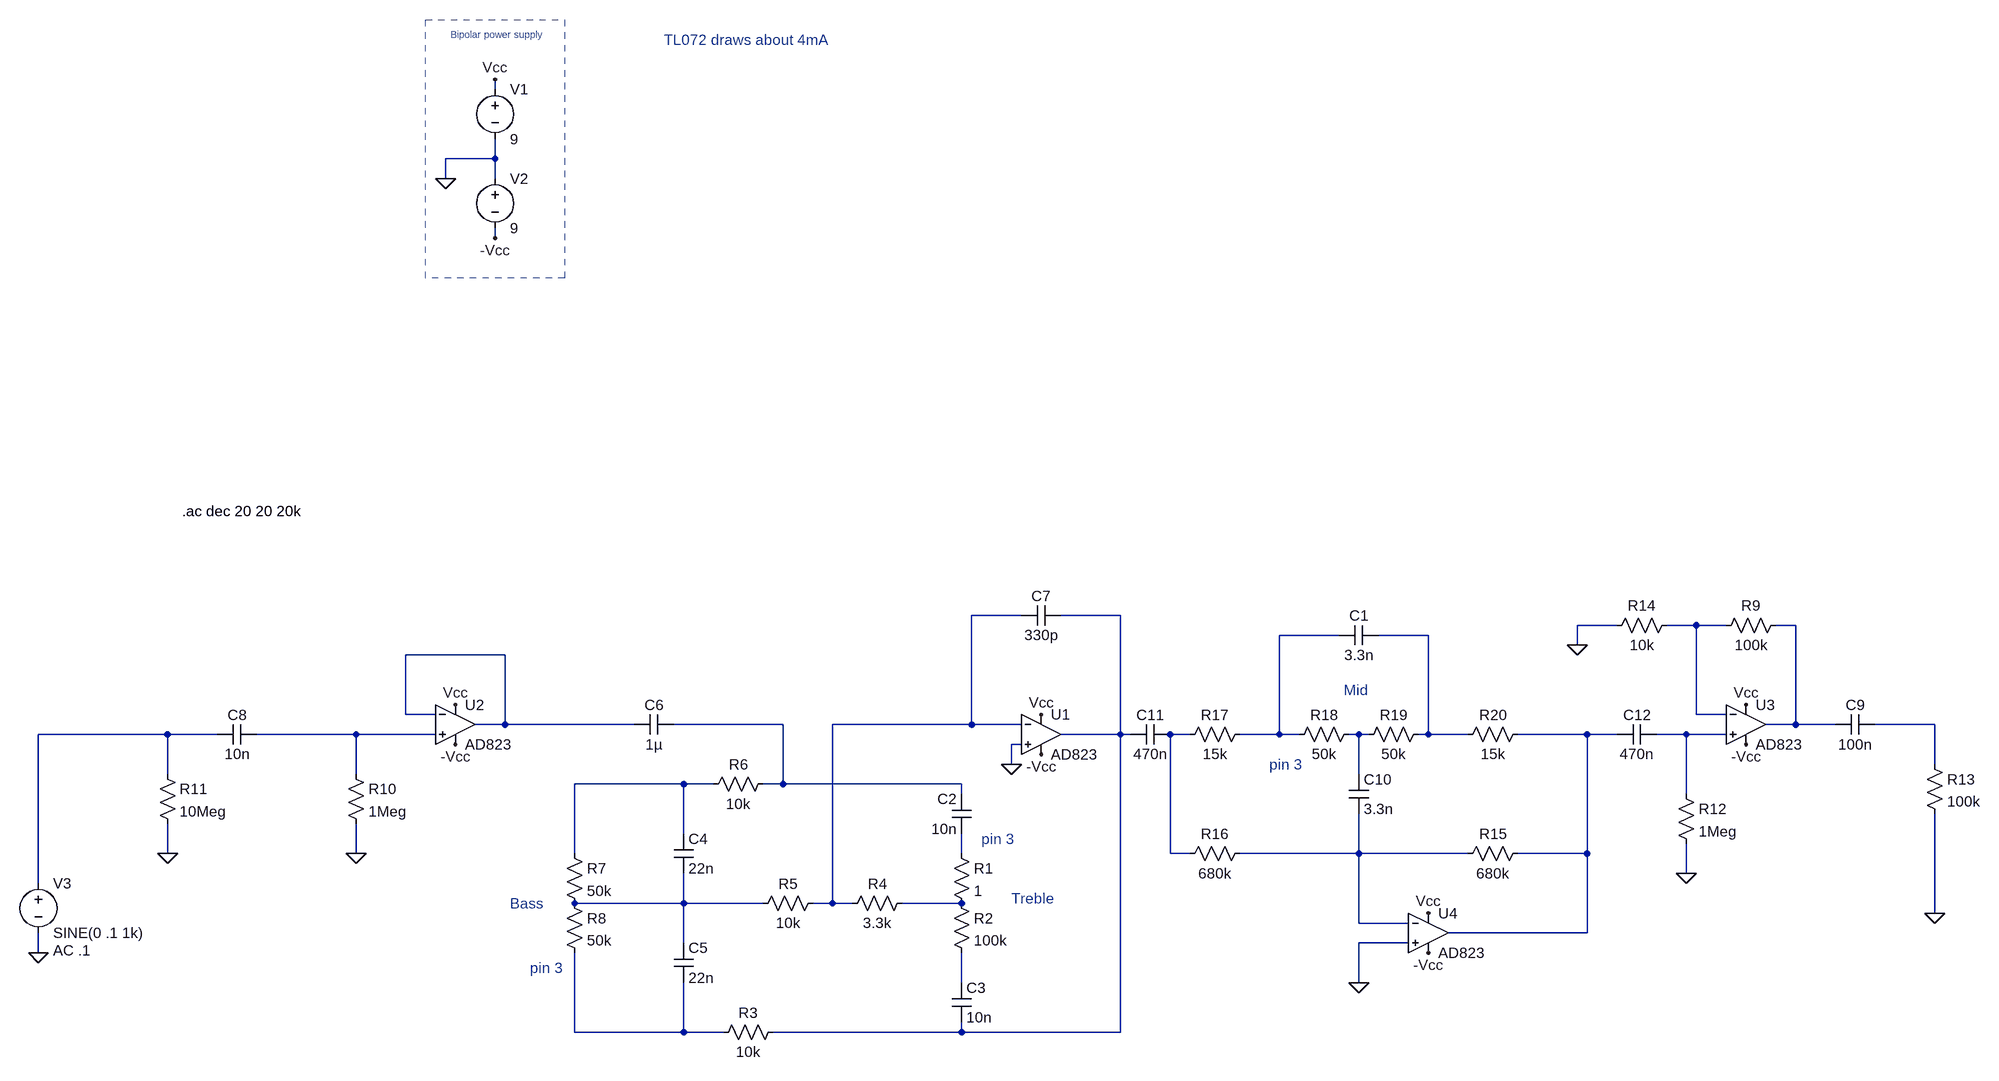
[diagram p0: schematic EQBoost.asc]
EQBoost.asc, the LTspice schematic file:
Version 4
SHEET 1 1924 680
WIRE -704 -960 -704 -976
WIRE -704 -848 -704 -880
WIRE -704 -848 -784 -848
WIRE -784 -816 -784 -848
WIRE -704 -816 -704 -848
WIRE -704 -720 -704 -736
WIRE 144 -112 64 -112
WIRE 304 -112 208 -112
WIRE 1104 -96 1040 -96
WIRE 1232 -96 1184 -96
WIRE 1280 -96 1232 -96
WIRE 1392 -96 1360 -96
WIRE 656 -80 560 -80
WIRE 800 -80 720 -80
WIRE 1040 -64 1040 -96
WIRE -688 -48 -848 -48
WIRE -848 48 -848 -48
WIRE -800 48 -848 48
WIRE 1232 48 1232 -96
WIRE 1280 48 1232 48
WIRE -688 64 -688 -48
WIRE -688 64 -736 64
WIRE -480 64 -688 64
WIRE -240 64 -416 64
WIRE 64 64 64 -112
WIRE 64 64 -160 64
WIRE 144 64 64 64
WIRE 1392 64 1392 -96
WIRE 1392 64 1344 64
WIRE 1456 64 1392 64
WIRE 1616 64 1520 64
WIRE -1232 80 -1440 80
WIRE -1152 80 -1232 80
WIRE -928 80 -1088 80
WIRE -800 80 -928 80
WIRE 304 80 304 -112
WIRE 304 80 208 80
WIRE 320 80 304 80
WIRE 416 80 384 80
WIRE 560 80 560 -80
WIRE 560 80 496 80
WIRE 592 80 560 80
WIRE 688 80 672 80
WIRE 704 80 688 80
WIRE 800 80 800 -80
WIRE 800 80 784 80
WIRE 864 80 800 80
WIRE 1056 80 944 80
WIRE 1104 80 1056 80
WIRE 1216 80 1168 80
WIRE 1280 80 1216 80
WIRE 144 96 128 96
WIRE 128 128 128 96
WIRE 1616 128 1616 64
WIRE -1232 144 -1232 80
WIRE -928 144 -928 80
WIRE 688 144 688 80
WIRE -400 160 -576 160
WIRE -352 160 -400 160
WIRE -240 160 -240 64
WIRE -240 160 -272 160
WIRE 48 160 -240 160
WIRE 48 176 48 160
WIRE 1216 176 1216 80
WIRE -400 240 -400 160
WIRE -1232 272 -1232 224
WIRE -928 272 -928 224
WIRE -576 272 -576 160
WIRE 48 272 48 240
WIRE 384 272 384 80
WIRE 416 272 384 272
WIRE 688 272 688 208
WIRE 688 272 496 272
WIRE 864 272 688 272
WIRE 1056 272 1056 80
WIRE 1056 272 944 272
WIRE 1216 304 1216 256
WIRE -1440 320 -1440 80
WIRE -400 352 -400 304
WIRE -400 352 -576 352
WIRE -272 352 -400 352
WIRE -160 352 -160 64
WIRE -160 352 -192 352
WIRE -128 352 -160 352
WIRE 48 352 -48 352
WIRE 1616 368 1616 208
WIRE 688 384 688 272
WIRE 768 384 688 384
WIRE 1056 400 1056 272
WIRE 1056 400 832 400
WIRE -400 416 -400 352
WIRE 768 416 688 416
WIRE -1440 432 -1440 400
WIRE 48 480 48 432
WIRE 688 480 688 416
WIRE -576 560 -576 432
WIRE -400 560 -400 480
WIRE -400 560 -576 560
WIRE -336 560 -400 560
WIRE 48 560 48 544
WIRE 48 560 -256 560
WIRE 304 560 304 80
WIRE 304 560 48 560
FLAG -784 -816 0
FLAG -704 -976 Vcc
FLAG -704 -720 -Vcc
FLAG 176 112 -Vcc
FLAG 176 48 Vcc
FLAG 128 128 0
FLAG -1440 432 0
FLAG -768 96 -Vcc
FLAG -768 32 Vcc
FLAG -928 272 0
FLAG -1232 272 0
FLAG 1312 96 -Vcc
FLAG 1312 32 Vcc
FLAG 1616 368 0
FLAG 1040 -64 0
FLAG 800 432 -Vcc
FLAG 800 368 Vcc
FLAG 688 480 0
FLAG 1216 304 0
DATAFLAG -704 -976 ""
DATAFLAG 688 352 ""
DATAFLAG 976 400 ""
DATAFLAG 1584 64 ""
SYMBOL Opamps\\AD823 176 16 R0
SYMATTR InstName U1
SYMBOL voltage -704 -976 R0
WINDOW 123 0 0 Left 2
WINDOW 39 0 0 Left 2
SYMATTR InstName V1
SYMATTR Value 9
SYMBOL voltage -704 -832 R0
WINDOW 123 0 0 Left 2
WINDOW 39 0 0 Left 2
SYMATTR InstName V2
SYMATTR Value 9
SYMBOL cap 64 240 R180
WINDOW 0 24 56 Left 2
WINDOW 3 24 8 Left 2
SYMATTR InstName C2
SYMATTR Value 10n
SYMBOL res 32 256 R0
SYMATTR InstName R1
SYMATTR Value 1
SYMBOL res 32 336 R0
SYMATTR InstName R2
SYMATTR Value 100k
SYMBOL cap 32 480 R0
SYMATTR InstName C3
SYMATTR Value 10n
SYMBOL res -240 544 R90
WINDOW 0 0 56 VBottom 2
WINDOW 3 32 56 VTop 2
SYMATTR InstName R3
SYMATTR Value 10k
SYMBOL res -32 336 R90
WINDOW 0 0 56 VBottom 2
WINDOW 3 32 56 VTop 2
SYMATTR InstName R4
SYMATTR Value 3.3k
SYMBOL res -176 336 R90
WINDOW 0 0 56 VBottom 2
WINDOW 3 32 56 VTop 2
SYMATTR InstName R5
SYMATTR Value 10k
SYMBOL res -256 144 R90
WINDOW 0 0 56 VBottom 2
WINDOW 3 32 56 VTop 2
SYMATTR InstName R6
SYMATTR Value 10k
SYMBOL cap -416 240 R0
SYMATTR InstName C4
SYMATTR Value 22n
SYMBOL cap -416 416 R0
SYMATTR InstName C5
SYMATTR Value 22n
SYMBOL res -592 256 R0
SYMATTR InstName R7
SYMATTR Value 50k
SYMBOL res -592 336 R0
SYMATTR InstName R8
SYMATTR Value 50k
SYMBOL cap -416 48 R90
WINDOW 0 0 32 VBottom 2
WINDOW 3 32 32 VTop 2
SYMATTR InstName C6
SYMATTR Value 1µ
SYMBOL cap 144 -96 R270
WINDOW 0 32 32 VTop 2
WINDOW 3 0 32 VBottom 2
SYMATTR InstName C7
SYMATTR Value 330p
SYMBOL Opamps\\AD823 -768 0 R0
SYMATTR InstName U2
SYMBOL cap -1088 64 R90
WINDOW 0 0 32 VBottom 2
WINDOW 3 32 32 VTop 2
SYMATTR InstName C8
SYMATTR Value 10n
SYMBOL res -944 128 R0
SYMATTR InstName R10
SYMATTR Value 1Meg
SYMBOL res -1248 128 R0
SYMATTR InstName R11
SYMATTR Value 10Meg
SYMBOL Opamps\\AD823 1312 0 R0
SYMATTR InstName U3
SYMBOL res 1600 112 R0
SYMATTR InstName R13
SYMATTR Value 100k
SYMBOL cap 1520 48 R90
WINDOW 0 0 32 VBottom 2
WINDOW 3 32 32 VTop 2
SYMATTR InstName C9
SYMATTR Value 100n
SYMBOL res 1376 -112 R90
WINDOW 0 0 56 VBottom 2
WINDOW 3 32 56 VTop 2
SYMATTR InstName R9
SYMATTR Value 100k
SYMBOL res 1200 -112 R90
WINDOW 0 0 56 VBottom 2
WINDOW 3 32 56 VTop 2
SYMATTR InstName R14
SYMATTR Value 10k
SYMBOL Opamps\\AD823 800 336 R0
SYMATTR InstName U4
SYMBOL res 960 256 R90
WINDOW 0 0 56 VBottom 2
WINDOW 3 32 56 VTop 2
SYMATTR InstName R15
SYMATTR Value 680k
SYMBOL res 512 256 R90
WINDOW 0 0 56 VBottom 2
WINDOW 3 32 56 VTop 2
SYMATTR InstName R16
SYMATTR Value 680k
SYMBOL res 512 64 R90
WINDOW 0 0 56 VBottom 2
WINDOW 3 32 56 VTop 2
SYMATTR InstName R17
SYMATTR Value 15k
SYMBOL res 688 64 R90
WINDOW 0 0 56 VBottom 2
WINDOW 3 32 56 VTop 2
SYMATTR InstName R18
SYMATTR Value 50k
SYMBOL res 800 64 R90
WINDOW 0 0 56 VBottom 2
WINDOW 3 32 56 VTop 2
SYMATTR InstName R19
SYMATTR Value 50k
SYMBOL res 960 64 R90
WINDOW 0 0 56 VBottom 2
WINDOW 3 32 56 VTop 2
SYMATTR InstName R20
SYMATTR Value 15k
SYMBOL cap 720 -96 R90
WINDOW 0 0 32 VBottom 2
WINDOW 3 32 32 VTop 2
SYMATTR InstName C1
SYMATTR Value 3.3n
SYMBOL cap 672 144 R0
SYMATTR InstName C10
SYMATTR Value 3.3n
SYMBOL cap 384 64 R90
WINDOW 0 0 32 VBottom 2
WINDOW 3 32 32 VTop 2
SYMATTR InstName C11
SYMATTR Value 470n
SYMBOL cap 1168 64 R90
WINDOW 0 0 32 VBottom 2
WINDOW 3 32 32 VTop 2
SYMATTR InstName C12
SYMATTR Value 470n
SYMBOL res 1200 160 R0
SYMATTR InstName R12
SYMATTR Value 1Meg
SYMBOL voltage -1440 304 R0
WINDOW 123 24 124 Left 2
WINDOW 39 0 0 Left 2
SYMATTR Value2 AC .1
SYMATTR InstName V3
SYMATTR Value SINE(0 .1 1k)
TEXT -776 -1048 Left 1 ;Bipolar power supply
TEXT 80 248 Left 2 ;pin 3
TEXT -648 456 Left 2 ;pin 3
TEXT 544 128 Left 2 ;pin 3
TEXT -432 -1040 Left 2 ;TL072 draws about 4mA
TEXT -680 352 Left 2 ;Bass
TEXT 128 344 Left 2 ;Treble
TEXT 664 8 Left 2 ;Mid
TEXT -1208 -280 Left 2 !.ac dec 20 20 20k
RECTANGLE Normal -592 -656 -816 -1072 2

The netlist it stands for:
* EQBoost.asc
XU1 0 N001 Vcc -Vcc N002 AD823  ; pins In+ In- V+ V- OUT
V1 Vcc 0 9
V2 0 -Vcc 9
C2 N017 N008 10n
R1 N017 N020 1
R2 N020 N021 100k
C3 N021 N002 10n
R3 N002 N022 10k
R4 N020 N001 3.3k
R5 N001 N019 10k
R6 N008 N016 10k
C4 N016 N019 22n
C5 N019 N022 22n
R7 N016 N019 50k
R8 N019 N022 50k
C6 N008 N007 1µ
C7 N001 N002 330p
XU2 N011 N007 Vcc -Vcc N007 AD823  ; pins In+ In- V+ V- OUT
C8 N011 N010 10n
R10 N011 0 1Meg
R11 N010 0 10Meg
XU3 N015 N003 Vcc -Vcc N004 AD823  ; pins In+ In- V+ V- OUT
R13 N009 0 100k
C9 N009 N004 100n
R9 N004 N003 100k
R14 N003 0 10k
XU4 0 N018 Vcc -Vcc N014 AD823  ; pins In+ In- V+ V- OUT
R15 N014 N018 680k
R16 N018 N012 680k
R17 N005 N012 15k
R18 N013 N005 50k
R19 N006 N013 50k
R20 N014 N006 15k
C1 N006 N005 3.3n
C10 N013 N018 3.3n
C11 N012 N002 470n
C12 N015 N014 470n
R12 N015 0 1Meg
V3 N010 0 SINE(0 .1 1k) AC .1
* Bipolar power supply
* pin 3
* pin 3
* pin 3
* TL072 draws about 4mA
* Bass
* Treble
* Mid
.ac dec 20 20 20k
.lib ADI.lib
.backanno
.end